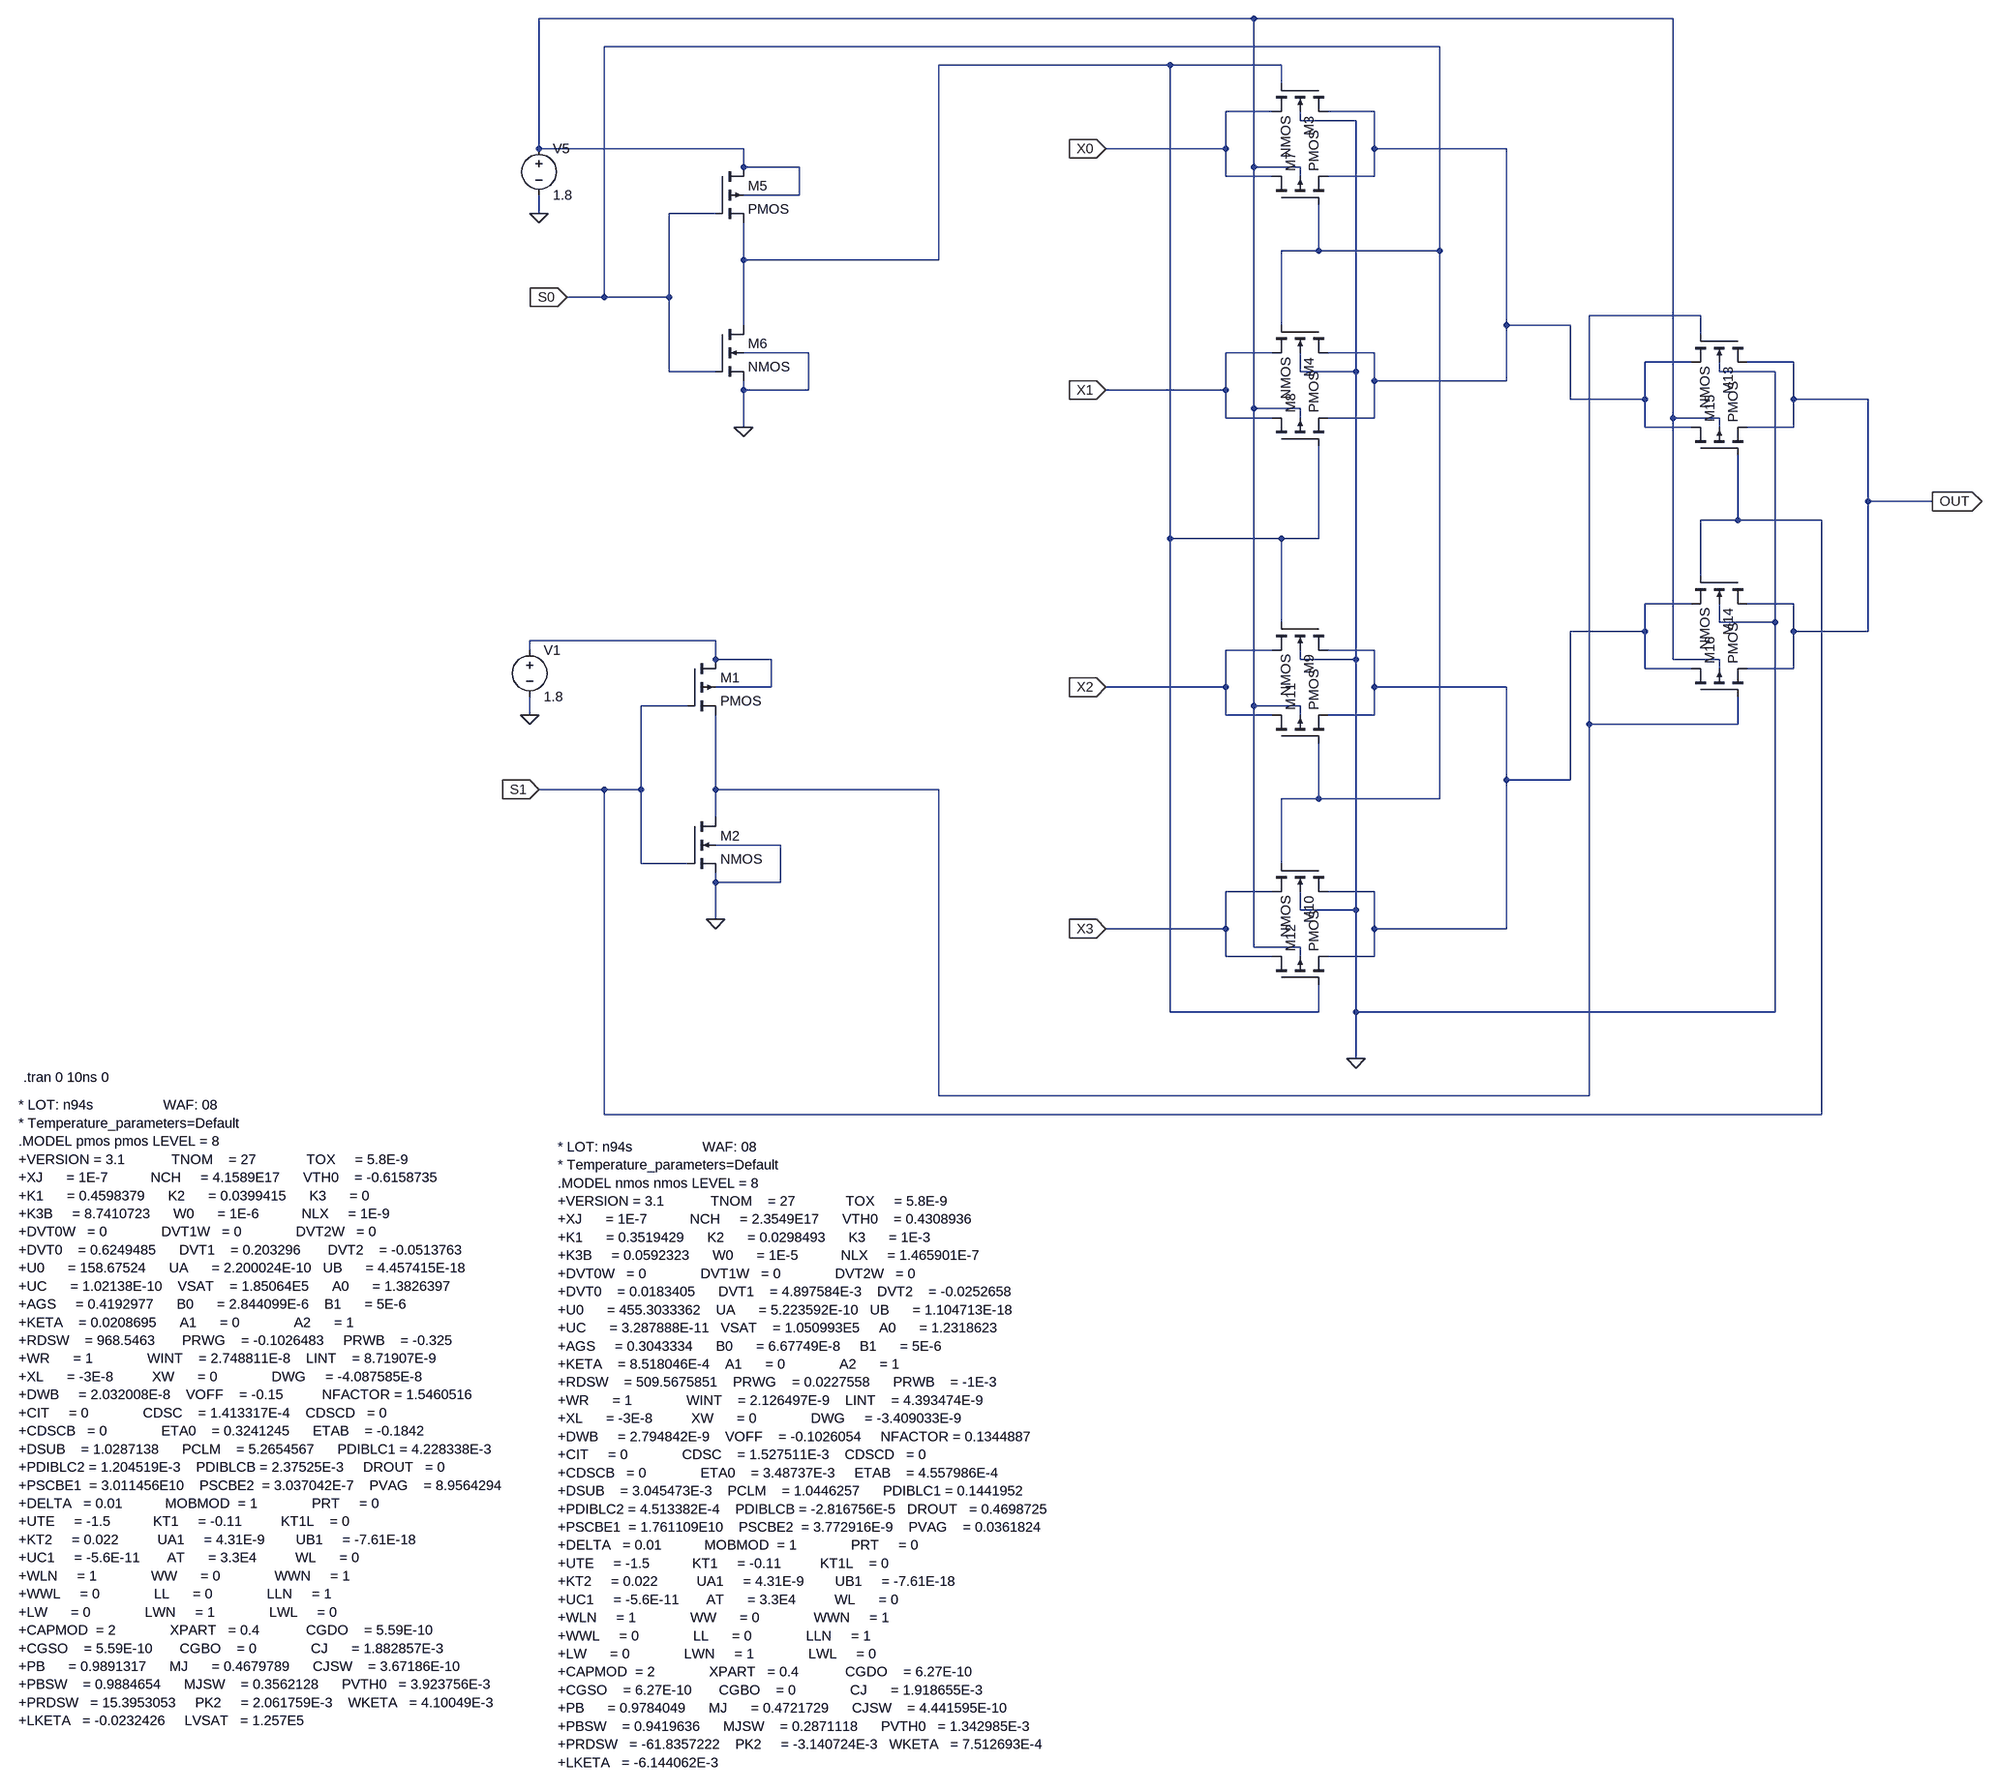
[diagram p0: schematic 4X1_MUX.asc]
4X1_MUX.asc, the LTspice schematic file:
Version 4
SHEET 1 1972 1732
WIRE 0 -976 -1232 -976
WIRE 960 -976 0 -976
WIRE 320 -928 -1120 -928
WIRE -144 -896 -544 -896
WIRE 48 -896 -144 -896
WIRE 48 -864 48 -896
WIRE 32 -816 -48 -816
WIRE 208 -816 128 -816
WIRE 80 -800 80 -816
WIRE 176 -800 80 -800
WIRE -1232 -752 -1232 -976
WIRE -880 -752 -1232 -752
WIRE -48 -752 -48 -816
WIRE -48 -752 -256 -752
WIRE 208 -752 208 -816
WIRE 464 -752 208 -752
WIRE -880 -720 -880 -752
WIRE -784 -720 -880 -720
WIRE 0 -720 0 -976
WIRE 80 -720 0 -720
WIRE -48 -704 -48 -752
WIRE 32 -704 -48 -704
WIRE 80 -704 80 -720
WIRE 208 -704 208 -752
WIRE 208 -704 128 -704
WIRE -784 -672 -784 -720
WIRE -784 -672 -880 -672
WIRE -1232 -640 -1232 -672
WIRE -928 -640 -1008 -640
WIRE 112 -576 112 -656
WIRE 112 -576 48 -576
WIRE 320 -576 320 -928
WIRE 320 -576 112 -576
WIRE -880 -560 -880 -624
WIRE -544 -560 -544 -896
WIRE -544 -560 -880 -560
WIRE -1120 -496 -1120 -928
WIRE -1120 -496 -1184 -496
WIRE -1008 -496 -1008 -640
WIRE -1008 -496 -1120 -496
WIRE 1008 -464 816 -464
WIRE -880 -448 -880 -560
WIRE 48 -448 48 -576
WIRE 464 -448 464 -752
WIRE 784 -448 464 -448
WIRE 1008 -432 1008 -464
WIRE -768 -400 -880 -400
WIRE 32 -400 -48 -400
WIRE 208 -400 128 -400
WIRE 992 -384 912 -384
WIRE 1168 -384 1088 -384
WIRE -1008 -368 -1008 -496
WIRE -928 -368 -1008 -368
WIRE 80 -368 80 -400
WIRE 176 -368 176 -800
WIRE 176 -368 80 -368
WIRE 1040 -368 1040 -384
WIRE 1136 -368 1040 -368
WIRE 208 -352 208 -400
WIRE 464 -352 464 -448
WIRE 464 -352 208 -352
WIRE -880 -336 -880 -352
WIRE -768 -336 -768 -400
WIRE -768 -336 -880 -336
WIRE -48 -336 -48 -400
WIRE -48 -336 -256 -336
WIRE 784 -320 784 -448
WIRE 912 -320 912 -384
WIRE 912 -320 784 -320
WIRE 1168 -320 1168 -384
WIRE 1296 -320 1168 -320
WIRE 0 -304 0 -720
WIRE 80 -304 0 -304
WIRE -48 -288 -48 -336
WIRE 32 -288 -48 -288
WIRE 80 -288 80 -304
WIRE 208 -288 208 -352
WIRE 208 -288 128 -288
WIRE 960 -288 960 -976
WIRE 1040 -288 960 -288
WIRE -880 -272 -880 -336
WIRE 912 -272 912 -320
WIRE 992 -272 912 -272
WIRE 1040 -272 1040 -288
WIRE 1168 -272 1168 -320
WIRE 1168 -272 1088 -272
WIRE 1296 -144 1296 -320
WIRE 1440 -144 1296 -144
WIRE 1072 -112 1072 -224
WIRE 1072 -112 1008 -112
WIRE 1216 -112 1072 -112
WIRE -144 -80 -144 -896
WIRE 48 -80 -144 -80
WIRE 112 -80 112 -240
WIRE 112 -80 48 -80
WIRE 1008 -16 1008 -112
WIRE 992 32 912 32
WIRE 1168 32 1088 32
WIRE 48 64 48 -80
WIRE 1040 64 1040 32
WIRE 1136 64 1136 -368
WIRE 1136 64 1040 64
WIRE 912 80 912 32
WIRE 912 80 784 80
WIRE 1168 80 1168 32
WIRE 1296 80 1296 -144
WIRE 1296 80 1168 80
WIRE -928 96 -1248 96
WIRE -1248 112 -1248 96
WIRE 32 112 -48 112
WIRE 208 112 128 112
WIRE -928 128 -928 96
WIRE -832 128 -928 128
WIRE 80 128 80 112
WIRE 176 128 176 -368
WIRE 176 128 80 128
WIRE 960 128 960 -288
WIRE 1040 128 960 128
WIRE 912 144 912 80
WIRE 992 144 912 144
WIRE 1040 144 1040 128
WIRE 1168 144 1168 80
WIRE 1168 144 1088 144
WIRE -832 176 -832 128
WIRE -832 176 -928 176
WIRE -48 176 -48 112
WIRE -48 176 -256 176
WIRE 208 176 208 112
WIRE 464 176 208 176
WIRE -976 208 -1056 208
WIRE 0 208 0 -304
WIRE 80 208 0 208
WIRE -1248 224 -1248 192
WIRE -48 224 -48 176
WIRE 32 224 -48 224
WIRE 80 224 80 208
WIRE 208 224 208 176
WIRE 208 224 128 224
WIRE 816 240 816 -464
WIRE 1072 240 1072 192
WIRE 1072 240 816 240
WIRE 464 336 464 176
WIRE 784 336 784 80
WIRE 784 336 464 336
WIRE -1120 352 -1232 352
WIRE -1056 352 -1056 208
WIRE -1056 352 -1120 352
WIRE -928 352 -928 224
WIRE -544 352 -928 352
WIRE 112 368 112 272
WIRE 112 368 48 368
WIRE 320 368 320 -576
WIRE 320 368 112 368
WIRE -928 400 -928 352
WIRE -816 448 -928 448
WIRE -1056 480 -1056 352
WIRE -976 480 -1056 480
WIRE 48 480 48 368
WIRE -928 512 -928 496
WIRE -816 512 -816 448
WIRE -816 512 -928 512
WIRE 32 528 -48 528
WIRE 208 528 128 528
WIRE 80 560 80 528
WIRE 176 560 176 128
WIRE 176 560 80 560
WIRE -928 576 -928 512
WIRE -48 592 -48 528
WIRE -48 592 -256 592
WIRE 208 592 208 528
WIRE 464 592 464 336
WIRE 464 592 208 592
WIRE 0 624 0 208
WIRE 80 624 0 624
WIRE -48 640 -48 592
WIRE 32 640 -48 640
WIRE 80 640 80 624
WIRE 208 640 208 592
WIRE 208 640 128 640
WIRE -144 736 -144 -80
WIRE 112 736 112 688
WIRE 112 736 -144 736
WIRE 176 736 176 560
WIRE 1136 736 1136 64
WIRE 1136 736 176 736
WIRE 176 816 176 736
WIRE -544 880 -544 352
WIRE 816 880 816 240
WIRE 816 880 -544 880
WIRE -1120 912 -1120 352
WIRE 1216 912 1216 -112
WIRE 1216 912 -1120 912
FLAG -928 576 0
FLAG -880 -272 0
FLAG -1232 -640 0
FLAG -1248 224 0
FLAG 176 816 0
FLAG -1184 -496 S0
IOPIN -1184 -496 In
FLAG -1232 352 S1
IOPIN -1232 352 In
FLAG -256 -752 X0
IOPIN -256 -752 In
FLAG -256 -336 X1
IOPIN -256 -336 In
FLAG -256 176 X2
IOPIN -256 176 In
FLAG -256 592 X3
IOPIN -256 592 In
FLAG 1440 -144 OUT
IOPIN 1440 -144 Out
SYMBOL nmos4 128 -864 R90
SYMATTR InstName M3
SYMATTR Value2 l=180n w=440n
SYMBOL nmos4 128 -448 R90
SYMATTR InstName M4
SYMATTR Value2 l=180n w=440n
SYMBOL pmos4 -976 128 R0
SYMATTR InstName M1
SYMATTR Value2 l=180n w=880n
SYMBOL nmos4 -976 400 R0
SYMATTR InstName M2
SYMATTR Value2 l=180n w=440n
SYMBOL pmos4 -928 -720 R0
SYMATTR InstName M5
SYMATTR Value2 l=180n w=880n
SYMBOL nmos4 -928 -448 R0
SYMATTR InstName M6
SYMATTR Value2 l=180n w=440n
SYMBOL voltage -1232 -768 R0
SYMATTR InstName V5
SYMATTR Value 1.8
SYMBOL pmos4 32 -656 R270
SYMATTR InstName M7
SYMATTR Value2 l=180n w=440n
SYMBOL pmos4 32 -240 R270
SYMATTR InstName M8
SYMATTR Value2 l=180n w=440n
SYMBOL Voltage -1248 96 R0
SYMATTR InstName V1
SYMATTR Value 1.8
SYMBOL nmos4 128 64 R90
SYMATTR InstName M9
SYMATTR Value2 l=180n w=440n
SYMBOL nmos4 128 480 R90
SYMATTR InstName M10
SYMATTR Value2 l=180n w=440n
SYMBOL pmos4 32 272 R270
SYMATTR InstName M11
SYMATTR Value2 l=180n w=440n
SYMBOL pmos4 32 688 R270
SYMATTR InstName M12
SYMATTR Value2 l=180n w=440n
SYMBOL nmos4 1088 -432 R90
SYMATTR InstName M13
SYMATTR Value2 l=180n w=440n
SYMBOL nmos4 1088 -16 R90
SYMATTR InstName M14
SYMATTR Value2 l=180n w=440n
SYMBOL pmos4 992 -224 R270
SYMATTR InstName M15
SYMATTR Value2 l=180n w=440n
SYMBOL pmos4 992 192 R270
SYMATTR InstName M16
SYMATTR Value2 l=180n w=440n
TEXT -2120 848 Left 2 !.tran 0 10ns 0
TEXT -1200 968 Left 2 !* LOT: n94s                  WAF: 08\n* Temperature_parameters=Default\n.MODEL nmos nmos LEVEL = 8\n+VERSION = 3.1            TNOM    = 27             TOX     = 5.8E-9\n+XJ      = 1E-7           NCH     = 2.3549E17      VTH0    = 0.4308936\n+K1      = 0.3519429      K2      = 0.0298493      K3      = 1E-3\n+K3B     = 0.0592323      W0      = 1E-5           NLX     = 1.465901E-7\n+DVT0W   = 0              DVT1W   = 0              DVT2W   = 0\n+DVT0    = 0.0183405      DVT1    = 4.897584E-3    DVT2    = -0.0252658\n+U0      = 455.3033362    UA      = 5.223592E-10   UB      = 1.104713E-18\n+UC      = 3.287888E-11   VSAT    = 1.050993E5     A0      = 1.2318623\n+AGS     = 0.3043334      B0      = 6.67749E-8     B1      = 5E-6\n+KETA    = 8.518046E-4    A1      = 0              A2      = 1\n+RDSW    = 509.5675851    PRWG    = 0.0227558      PRWB    = -1E-3\n+WR      = 1              WINT    = 2.126497E-9    LINT    = 4.393474E-9\n+XL      = -3E-8          XW      = 0              DWG     = -3.409033E-9\n+DWB     = 2.794842E-9    VOFF    = -0.1026054     NFACTOR = 0.1344887\n+CIT     = 0              CDSC    = 1.527511E-3    CDSCD   = 0\n+CDSCB   = 0              ETA0    = 3.48737E-3     ETAB    = 4.557986E-4\n+DSUB    = 3.045473E-3    PCLM    = 1.0446257      PDIBLC1 = 0.1441952\n+PDIBLC2 = 4.513382E-4    PDIBLCB = -2.816756E-5   DROUT   = 0.4698725\n+PSCBE1  = 1.761109E10    PSCBE2  = 3.772916E-9    PVAG    = 0.0361824\n+DELTA   = 0.01           MOBMOD  = 1              PRT     = 0\n+UTE     = -1.5           KT1     = -0.11          KT1L    = 0\n+KT2     = 0.022          UA1     = 4.31E-9        UB1     = -7.61E-18\n+UC1     = -5.6E-11       AT      = 3.3E4          WL      = 0\n+WLN     = 1              WW      = 0              WWN     = 1\n+WWL     = 0              LL      = 0              LLN     = 1\n+LW      = 0              LWN     = 1              LWL     = 0\n+CAPMOD  = 2              XPART   = 0.4            CGDO    = 6.27E-10\n+CGSO    = 6.27E-10       CGBO    = 0              CJ      = 1.918655E-3\n+PB      = 0.9784049      MJ      = 0.4721729      CJSW    = 4.441595E-10\n+PBSW    = 0.9419636      MJSW    = 0.2871118      PVTH0   = 1.342985E-3\n+PRDSW   = -61.8357222    PK2     = -3.140724E-3   WKETA   = 7.512693E-4\n+LKETA   = -6.144062E-3
TEXT -2128 896 Left 2 !* LOT: n94s                  WAF: 08\n* Temperature_parameters=Default\n.MODEL pmos pmos LEVEL = 8\n+VERSION = 3.1            TNOM    = 27             TOX     = 5.8E-9\n+XJ      = 1E-7           NCH     = 4.1589E17      VTH0    = -0.6158735\n+K1      = 0.4598379      K2      = 0.0399415      K3      = 0\n+K3B     = 8.7410723      W0      = 1E-6           NLX     = 1E-9\n+DVT0W   = 0              DVT1W   = 0              DVT2W   = 0\n+DVT0    = 0.6249485      DVT1    = 0.203296       DVT2    = -0.0513763\n+U0      = 158.67524      UA      = 2.200024E-10   UB      = 4.457415E-18\n+UC      = 1.02138E-10    VSAT    = 1.85064E5      A0      = 1.3826397\n+AGS     = 0.4192977      B0      = 2.844099E-6    B1      = 5E-6\n+KETA    = 0.0208695      A1      = 0              A2      = 1\n+RDSW    = 968.5463       PRWG    = -0.1026483     PRWB    = -0.325\n+WR      = 1              WINT    = 2.748811E-8    LINT    = 8.71907E-9\n+XL      = -3E-8          XW      = 0              DWG     = -4.087585E-8\n+DWB     = 2.032008E-8    VOFF    = -0.15          NFACTOR = 1.5460516\n+CIT     = 0              CDSC    = 1.413317E-4    CDSCD   = 0\n+CDSCB   = 0              ETA0    = 0.3241245      ETAB    = -0.1842\n+DSUB    = 1.0287138      PCLM    = 5.2654567      PDIBLC1 = 4.228338E-3\n+PDIBLC2 = 1.204519E-3    PDIBLCB = 2.37525E-3     DROUT   = 0\n+PSCBE1  = 3.011456E10    PSCBE2  = 3.037042E-7    PVAG    = 8.9564294\n+DELTA   = 0.01           MOBMOD  = 1              PRT     = 0\n+UTE     = -1.5           KT1     = -0.11          KT1L    = 0\n+KT2     = 0.022          UA1     = 4.31E-9        UB1     = -7.61E-18\n+UC1     = -5.6E-11       AT      = 3.3E4          WL      = 0\n+WLN     = 1              WW      = 0              WWN     = 1\n+WWL     = 0              LL      = 0              LLN     = 1\n+LW      = 0              LWN     = 1              LWL     = 0\n+CAPMOD  = 2              XPART   = 0.4            CGDO    = 5.59E-10\n+CGSO    = 5.59E-10       CGBO    = 0              CJ      = 1.882857E-3\n+PB      = 0.9891317      MJ      = 0.4679789      CJSW    = 3.67186E-10\n+PBSW    = 0.9884654      MJSW    = 0.3562128      PVTH0   = 3.923756E-3\n+PRDSW   = 15.3953053     PK2     = 2.061759E-3    WKETA   = 4.10049E-3\n+LKETA   = -0.0232426     LVSAT   = 1.257E5

The netlist it stands for:
* 4X1_MUX.asc
M3 N003 N002 X0 0 NMOS l=180n w=440n
M4 N003 S0 X1 0 NMOS l=180n w=440n
M1 N006 S1 N004 N006 PMOS l=180n w=880n
M2 N004 S1 0 0 NMOS l=180n w=440n
M5 N001 S0 N002 N001 PMOS l=180n w=880n
M6 N002 S0 0 0 NMOS l=180n w=440n
V5 N001 0 1.8
M7 X0 S0 N003 N001 PMOS l=180n w=440n
M8 X1 N002 N003 N001 PMOS l=180n w=440n
V1 N006 0 1.8
M9 N005 N002 X2 0 NMOS l=180n w=440n
M10 N005 S0 X3 0 NMOS l=180n w=440n
M11 X2 S0 N005 N001 PMOS l=180n w=440n
M12 X3 N002 N005 N001 PMOS l=180n w=440n
M13 OUT N004 N003 0 NMOS l=180n w=440n
M14 OUT S1 N005 0 NMOS l=180n w=440n
M15 N003 S1 OUT N001 PMOS l=180n w=440n
M16 N005 N004 OUT N001 PMOS l=180n w=440n
.model NMOS NMOS
.model PMOS PMOS
.lib standard.mos
.tran 0 10ns 0
* LOT: n94s                  WAF: 08
* Temperature_parameters=Default
.MODEL nmos nmos LEVEL = 8
+VERSION = 3.1            TNOM    = 27             TOX     = 5.8E-9
+XJ      = 1E-7           NCH     = 2.3549E17      VTH0    = 0.4308936
+K1      = 0.3519429      K2      = 0.0298493      K3      = 1E-3
+K3B     = 0.0592323      W0      = 1E-5           NLX     = 1.465901E-7
+DVT0W   = 0              DVT1W   = 0              DVT2W   = 0
+DVT0    = 0.0183405      DVT1    = 4.897584E-3    DVT2    = -0.0252658
+U0      = 455.3033362    UA      = 5.223592E-10   UB      = 1.104713E-18
+UC      = 3.287888E-11   VSAT    = 1.050993E5     A0      = 1.2318623
+AGS     = 0.3043334      B0      = 6.67749E-8     B1      = 5E-6
+KETA    = 8.518046E-4    A1      = 0              A2      = 1
+RDSW    = 509.5675851    PRWG    = 0.0227558      PRWB    = -1E-3
+WR      = 1              WINT    = 2.126497E-9    LINT    = 4.393474E-9
+XL      = -3E-8          XW      = 0              DWG     = -3.409033E-9
+DWB     = 2.794842E-9    VOFF    = -0.1026054     NFACTOR = 0.1344887
+CIT     = 0              CDSC    = 1.527511E-3    CDSCD   = 0
+CDSCB   = 0              ETA0    = 3.48737E-3     ETAB    = 4.557986E-4
+DSUB    = 3.045473E-3    PCLM    = 1.0446257      PDIBLC1 = 0.1441952
+PDIBLC2 = 4.513382E-4    PDIBLCB = -2.816756E-5   DROUT   = 0.4698725
+PSCBE1  = 1.761109E10    PSCBE2  = 3.772916E-9    PVAG    = 0.0361824
+DELTA   = 0.01           MOBMOD  = 1              PRT     = 0
+UTE     = -1.5           KT1     = -0.11          KT1L    = 0
+KT2     = 0.022          UA1     = 4.31E-9        UB1     = -7.61E-18
+UC1     = -5.6E-11       AT      = 3.3E4          WL      = 0
+WLN     = 1              WW      = 0              WWN     = 1
+WWL     = 0              LL      = 0              LLN     = 1
+LW      = 0              LWN     = 1              LWL     = 0
+CAPMOD  = 2              XPART   = 0.4            CGDO    = 6.27E-10
+CGSO    = 6.27E-10       CGBO    = 0              CJ      = 1.918655E-3
+PB      = 0.9784049      MJ      = 0.4721729      CJSW    = 4.441595E-10
+PBSW    = 0.9419636      MJSW    = 0.2871118      PVTH0   = 1.342985E-3
+PRDSW   = -61.8357222    PK2     = -3.140724E-3   WKETA   = 7.512693E-4
+LKETA   = -6.144062E-3
* LOT: n94s                  WAF: 08
* Temperature_parameters=Default
.MODEL pmos pmos LEVEL = 8
+VERSION = 3.1            TNOM    = 27             TOX     = 5.8E-9
+XJ      = 1E-7           NCH     = 4.1589E17      VTH0    = -0.6158735
+K1      = 0.4598379      K2      = 0.0399415      K3      = 0
+K3B     = 8.7410723      W0      = 1E-6           NLX     = 1E-9
+DVT0W   = 0              DVT1W   = 0              DVT2W   = 0
+DVT0    = 0.6249485      DVT1    = 0.203296       DVT2    = -0.0513763
+U0      = 158.67524      UA      = 2.200024E-10   UB      = 4.457415E-18
+UC      = 1.02138E-10    VSAT    = 1.85064E5      A0      = 1.3826397
+AGS     = 0.4192977      B0      = 2.844099E-6    B1      = 5E-6
+KETA    = 0.0208695      A1      = 0              A2      = 1
+RDSW    = 968.5463       PRWG    = -0.1026483     PRWB    = -0.325
+WR      = 1              WINT    = 2.748811E-8    LINT    = 8.71907E-9
+XL      = -3E-8          XW      = 0              DWG     = -4.087585E-8
+DWB     = 2.032008E-8    VOFF    = -0.15          NFACTOR = 1.5460516
+CIT     = 0              CDSC    = 1.413317E-4    CDSCD   = 0
+CDSCB   = 0              ETA0    = 0.3241245      ETAB    = -0.1842
+DSUB    = 1.0287138      PCLM    = 5.2654567      PDIBLC1 = 4.228338E-3
+PDIBLC2 = 1.204519E-3    PDIBLCB = 2.37525E-3     DROUT   = 0
+PSCBE1  = 3.011456E10    PSCBE2  = 3.037042E-7    PVAG    = 8.9564294
+DELTA   = 0.01           MOBMOD  = 1              PRT     = 0
+UTE     = -1.5           KT1     = -0.11          KT1L    = 0
+KT2     = 0.022          UA1     = 4.31E-9        UB1     = -7.61E-18
+UC1     = -5.6E-11       AT      = 3.3E4          WL      = 0
+WLN     = 1              WW      = 0              WWN     = 1
+WWL     = 0              LL      = 0              LLN     = 1
+LW      = 0              LWN     = 1              LWL     = 0
+CAPMOD  = 2              XPART   = 0.4            CGDO    = 5.59E-10
+CGSO    = 5.59E-10       CGBO    = 0              CJ      = 1.882857E-3
+PB      = 0.9891317      MJ      = 0.4679789      CJSW    = 3.67186E-10
+PBSW    = 0.9884654      MJSW    = 0.3562128      PVTH0   = 3.923756E-3
+PRDSW   = 15.3953053     PK2     = 2.061759E-3    WKETA   = 4.10049E-3
+LKETA   = -0.0232426     LVSAT   = 1.257E5
.backanno
.end